# EAGLE design TAM_UNO (EAGLE 6.3)
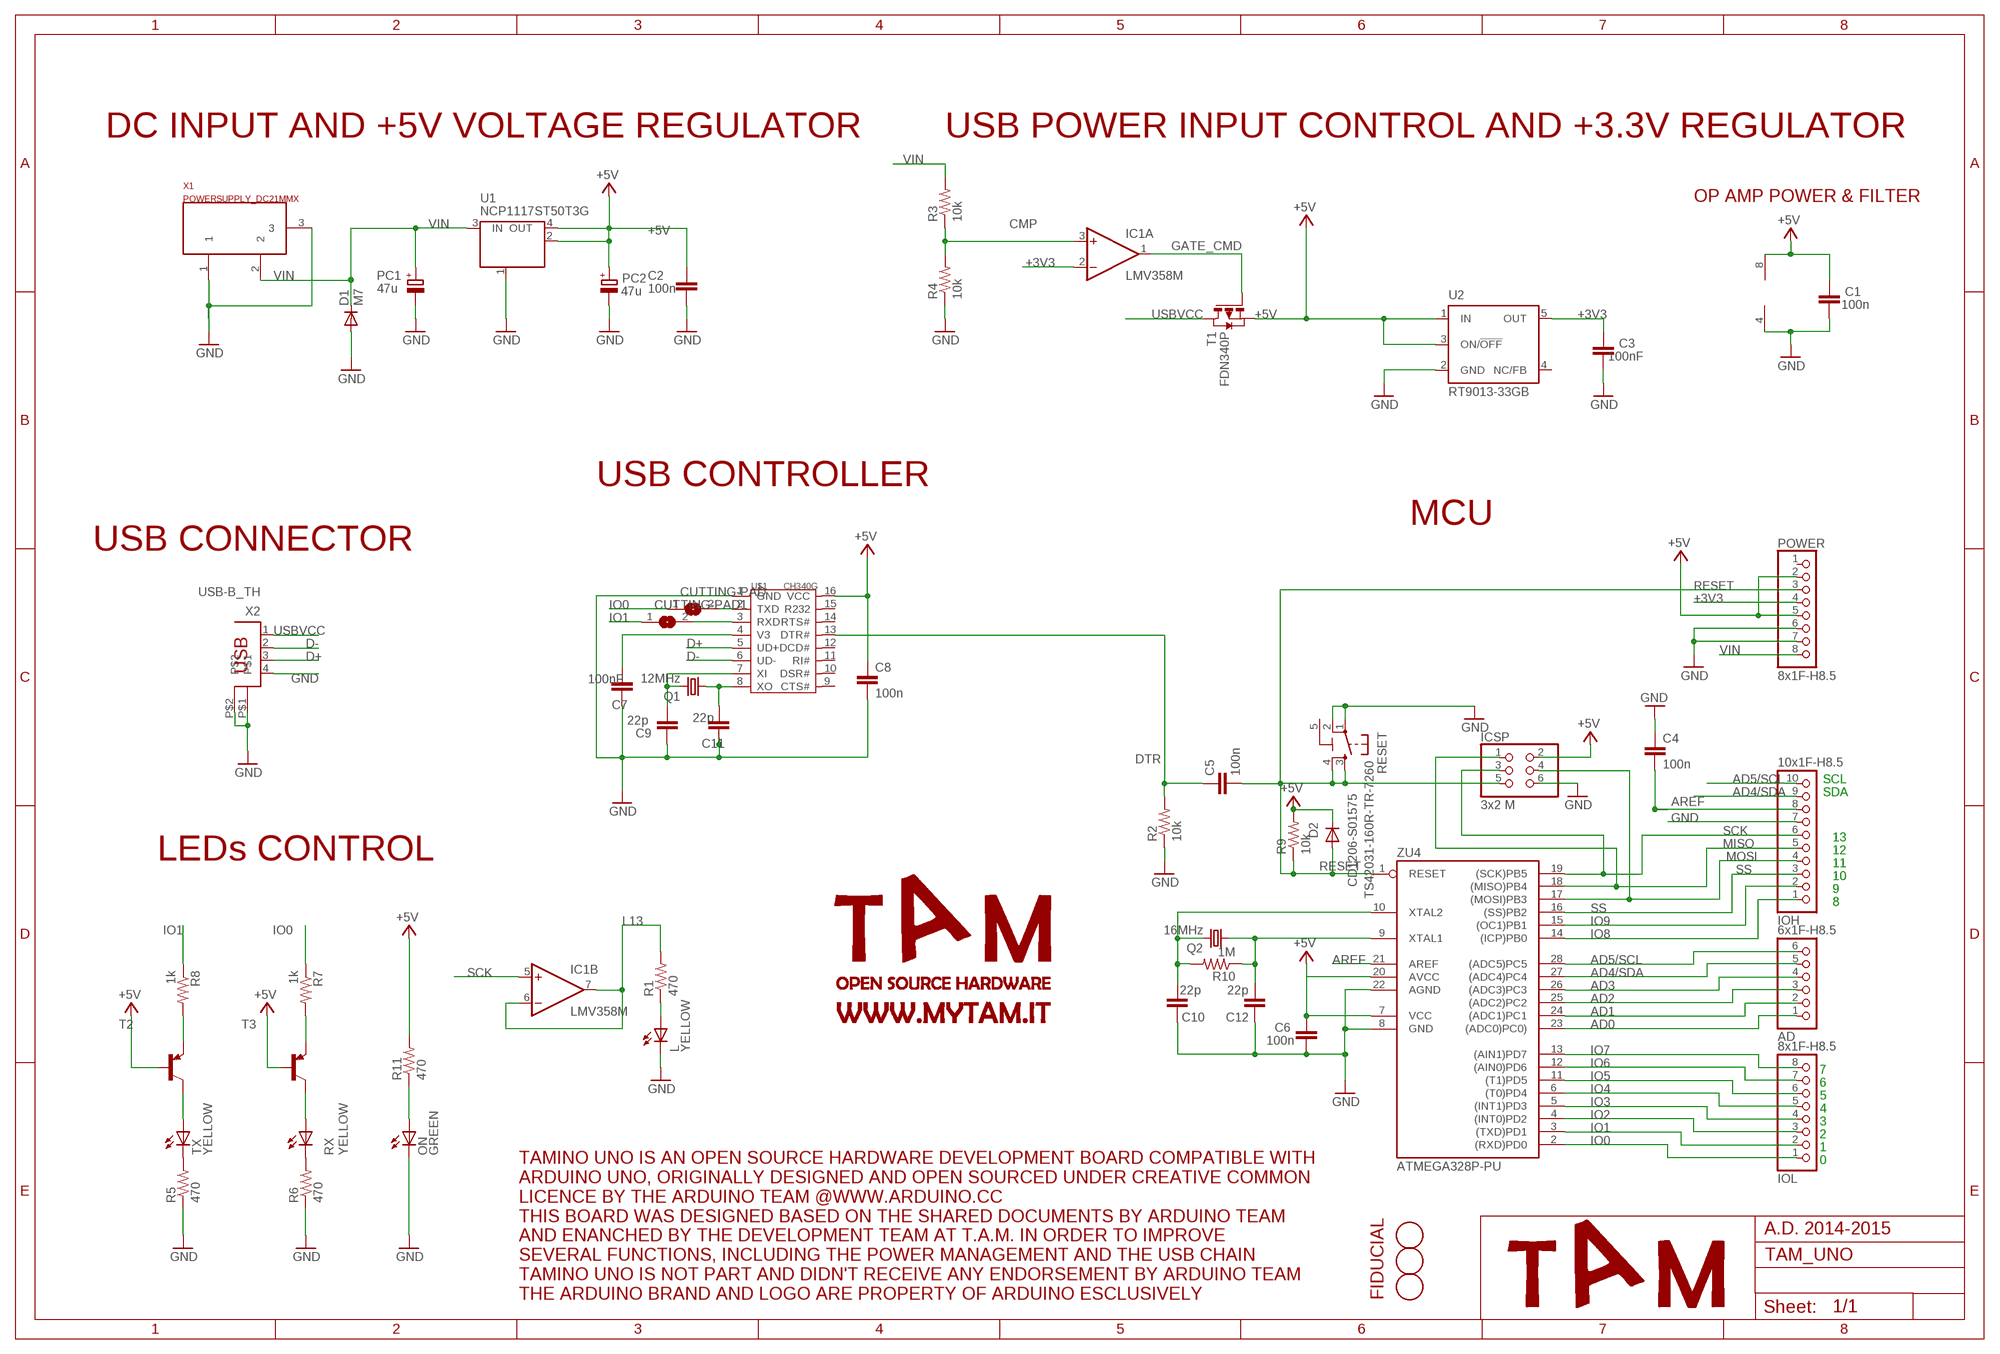
[diagram p0: schematic, sheet 1]

## Parts
AD  6x1F-H8.5  PINHD-1X6  [1X06]
C1  100n  C-EUC0603K  [C0603K]
C2  100n  C-EUC0603K  [C0603K]
C3  100nF  C-EUC0603K  [C0603K]
C4  100n  C-EUC0603K  [C0603K]
C5  100n  C-EUC0603K  [C0603K]
C6  100n  C-EUC0603K  [C0603K]
C7  100nF  C-EUC0603K  [C0603K]
C8  100n  C-EUC0603K  [C0603K]
C9  22p  C-EUC0603K  [C0603K]
C10  22p  C-EUC0603K  [C0603K]
C11  22p  C-EUC0603K  [C0603K]
C12  22p  C-EUC0603K  [C0603K]
CUTTING-PAD  SJ  [SJ]
CUTTING-PAD1  SJ  [SJ]
D1  M7  DIODE-SMB  [SMB]
D2  CD1206-S01575  DIODE-MINIMELF  [MINIMELF]
FD1  FIDUCIALMOUNT  [FIDUCIA-MOUNT]
FD2  FIDUCIALMOUNT  [FIDUCIA-MOUNT]
FD3  FIDUCIALMOUNT  [FIDUCIA-MOUNT]
IC1  LMV358M  [SO08]
ICSP  3x2 M  PINHD-2X3  [2X03]
IOH  10x1F-H8.5  PINHD-1X10_ARD  [1X10]
IOL  8x1F-H8.5  PINHD-1X8  [1X08]
L  YELLOW  LEDCHIP-LED0805  [CHIP-LED0805]
ON  GREEN  LEDCHIP-LED0805  [CHIP-LED0805]
PC1  47u  CPOL-EUD  [PANASONIC_D]
PC2  47u  CPOL-EUD  [PANASONIC_D]
POWER  8x1F-H8.5  PINHD-1X8  [1X08]
Q1  12MHz  CRYSTALSM49  [SM49]
Q2  16MHz  CRYSTALSM49  [SM49]
R1  470  R-US_R0603  [R0603]
R2  10k  R-US_R0603  [R0603]
R3  10k  R-US_R0603  [R0603]
R4  10k  R-US_R0603  [R0603]
R5  470  R-US_R0603  [R0603]
R6  470  R-US_R0603  [R0603]
R7  1k  R-US_R0603  [R0603]
R8  1k  R-US_R0603  [R0603]
R9  10k  R-US_R0603  [R0603]
R10  1M  R-US_R0603  [R0603]
R11  470  R-US_R0603  [R0603]
RESET  TS42031-160R-TR-7260  TS42  [TS42]
RX  YELLOW  LEDCHIP-LED0805  [CHIP-LED0805]
T1  FDN340P  PMOSSOT23  [SOT-23]
T2  -PNP-SOT23-EBC  [SOT23-EBC]
T3  -PNP-SOT23-EBC  [SOT23-EBC]
TX  YELLOW  LEDCHIP-LED0805  [CHIP-LED0805]
U1  NCP1117ST50T3G  MC33269ST-3.3T3  [SOT223]
U2  RT9013-33GB  LP2985-XXDBVR33  [SOT23-DBV]
U$1  CH340G  CH340GALT  [SSOP16]
X1  POWERSUPPLY_DC21MMX  [POWERSUPPLY_DC-21MM]
X2  USB-B_TH  PN61729  [PN61729]
ZU4  ATMEGA328P-PU  [DIL28-3]

## Nets
+3V3: C3.2 IC1.2(A:-IN) POWER.4 U2.5(OUT)
+5V [usbvcc]: C1.2 C2.2 C6.2 C8.1 D2.C IC1.8(P:V+) ICSP.2 PC2.+ POWER.2 POWER.5 R9.2 R11.2 T1.2(S) T2.B T3.B U1.2(OUT) U1.4(OUT) U2.1(IN) U2.3(ON/!OFF) U$1.16(VCC) ZU4.7(VCC) ZU4.20(AVCC)
AD0: AD.1 ZU4.23((ADC0)PC0))
AD1: AD.2 ZU4.24((ADC1)PC1)
AD2: AD.3 ZU4.25((ADC2)PC2)
AD3: AD.4 ZU4.26((ADC3)PC3)
AD4/SDA: AD.5 IOH.9 ZU4.27((ADC4)PC4)
AD5/SCL: AD.6 IOH.10 ZU4.28((ADC5)PC5)
AREF [aref]: C4.2 IOH.8 ZU4.21(AREF)
CMP: IC1.3(A:+IN) R3.1 R4.2
D+: U$1.5(UD+) X2.3
D-: U$1.6(UD-) X2.2
DTR: C5.1 R2.2 U$1.13(DTR#)
GATE_CMD: IC1.1(A:OUT) T1.3(G)
GND [gnd]: C1.1 C2.1 C3.1 C4.1 C6.1 C7.2 C8.2 C9.2 C10.2 C11.2 C12.2 D1.A IC1.4(P:V-) ICSP.6 IOH.7 L.C ON.C PC1.- PC2.- POWER.6 POWER.7 R2.1 R4.1 R5.1 R6.1 RESET.1 RESET.2 U1.1(GND/ADJ) U2.2(GND) U$1.1(GND) X1.1 X1.3 X2.4 X2.P$1 X2.P$2 ZU4.8(GND) ZU4.22(AGND)
IO0: CUTTING-PAD.1 IOL.1 R7.1 ZU4.2((RXD)PD0)
IO1: CUTTING-PAD1.1 IOL.2 R8.1 ZU4.3((TXD)PD1)
IO2: IOL.3 ZU4.4((INT0)PD2)
IO3: IOL.4 ZU4.5((INT1)PD3)
IO4: IOL.5 ZU4.6((T0)PD4)
IO5: IOL.6 ZU4.11((T1)PD5)
IO6: IOL.7 ZU4.12((AIN0)PD6)
IO7: IOL.8 ZU4.13((AIN1)PD7)
IO8: IOH.1 ZU4.14((ICP)PB0)
IO9: IOH.2 ZU4.15((OC1)PB1)
L13: IC1.6(B:-IN) IC1.7(B:OUT) R1.2
MISO: ICSP.1 IOH.5 ZU4.18((MISO)PB4)
MOSI: ICSP.4 IOH.4 ZU4.17((MOSI)PB3)
N$1: L.A R1.1
N$2: C9.1 Q1.2 U$1.7(XI)
N$3: ON.A R11.1
N$4: C11.1 Q1.1 U$1.8(XO)
N$5: R5.2 TX.C
N$6: R6.2 RX.C
N$7: R8.2 T2.E
N$8: R7.2 T3.E
N$9: T2.C TX.A
N$10: RX.A T3.C
N$11: C10.1 Q2.2 R10.2 ZU4.10(XTAL2)
N$12: C12.1 Q2.1 R10.1 ZU4.9(XTAL1)
N$13: CUTTING-PAD.2 U$1.2(TXD)
N$14: CUTTING-PAD1.2 U$1.3(RXD)
RESET: C5.2 D2.A ICSP.5 POWER.3 R9.1 RESET.3 RESET.4 ZU4.1(RESET)
SCK: IC1.5(B:+IN) ICSP.3 IOH.6 ZU4.19((SCK)PB5)
SS: IOH.3 ZU4.16((SS)PB2)
USBVCC [usbvcc]: T1.1(D) X2.1
V3: C7.1 U$1.4(V3)
VIN [power]: D1.C PC1.+ POWER.8 R3.2 U1.3(IN) X1.2
Unconnected: POWER.1 U2.4(NC/FB) U$1.9(CTS#) U$1.10(DSR#) U$1.11(RI#) U$1.12(DCD#) U$1.14(RTS#) U$1.15(R232)

## Notes on the sheet
- DC INPUT AND +5V VOLTAGE REGULATOR | USB POWER INPUT CONTROL AND +3.3V REGULATOR
- OP AMP POWER & FILTER
- USB CONTROLLER
- MCU
- USB CONNECTOR
- SCL
- SDA
- 13
- 12
- LEDs CONTROL
- 11
- 10
- 9
- 8
- 7
- 6
- 5
- 4
- 3
- 2
- 1
- 0
- A.D. 2014-2015
- TAMINO UNO IS AN OPEN SOURCE HARDWARE DEVELOPMENT BOARD COMPATIBLE WITH
  ARDUINO UNO, ORIGINALLY DESIGNED AND OPEN SOURCED UNDER CREATIVE COMMON
  LICENCE BY THE ARDUINO TEAM @WWW.ARDUINO.CC
  THIS BOARD WAS DESIGNED BASED ON THE SHARED DOCUMENTS BY ARDUINO TEAM
  AND ENANCHED BY THE DEVELOPMENT TEAM AT T.A.M. IN ORDER TO IMPROVE
  SEVERAL FUNCTIONS, INCLUDING THE POWER MANAGEMENT AND THE USB CHAIN
  TAMINO UNO IS NOT PART AND DIDN'T RECEIVE ANY ENDORSEMENT BY ARDUINO TEAM
  THE ARDUINO BRAND AND LOGO ARE PROPERTY OF ARDUINO ESCLUSIVELY
- FIDUCIAL

## Power pins joined to a net without a drawn wire
5-GND: RESET.5(5-GND)

## Library data of the parts
AD = SmartPrj:PINHD-1X6: PIN HEADER
C1-C12 = SmartPrj:C-EU: CAPACITOR, European symbol
CUTTING-PAD CUTTING-PAD1 = jumper:SJ: SMD solder JUMPER
D1 D2 = diode:DIODE-: DIODE
FD1-FD3 = SmartPrj:FIDUCIALMOUNT
IC1 = linear:LMV358?*: Dual General Purpose, Low Voltage, Rail-to-Rail Output Operational Amplifiers Source: http://www.national.com/mpf/LM/LMV321.html http://www.national.com/dt/lmv_qual.pdf
ICSP = SmartPrj:PINHD-2X3: PIN HEADER
IOH = SmartPrj:PINHD-1X10_ARD: PIN HEADER
IOL POWER = SmartPrj:PINHD-1X8: PIN HEADER
L ON RX TX = led:LED: LED OSRAM: - CHIPLED LG R971, LG N971, LY N971, LG Q971, LY Q971, LO R971, LY R971 LH N974, LH R974 LS Q976, LO Q976, LY Q976 LO Q996 - Hyper CHIPLED LW Q18S LB Q993, LB Q99A, LB R99A - SideLED LS A670, LO A670, LY A670, LG A670, LP A670 LB A673, LV A673, LT A673, LW A673 LH A674 LY A675 LS A676, LA A676, LO A676, LY A676, LW A676 LS A679, LY A679, LG A679 - Hyper Micro SIDELED® LS Y876, LA Y876, LO Y876, LY Y876 LT Y87S - SmartLED LW L88C, LW L88S LB L89C, LB L89S, LG L890 LS L89K, LO L89K, LY L89K LS L896, LA L896, LO L896, LY L896 - TOPLED LS T670, LO T670, LY T670, LG T670, LP T670 LSG T670, LSP T670, LSY T670, LOP T670, LYG T670 LG T671, LOG T671, LSG T671 LB T673, LV T673, LT T673, LW T673 LH T674 LS T676, LA T676, LO T676, LY T676, LB T676, LH T676, LSB T676, LW T676 LB T67C, LV T67C, LT T67C, LS T67K, LO T67K, LY T67K, LW E67C LS E67B, LA E67B, LO E67B, LY E67B, LB E67C, LV E67C, LT E67C LW T67C LS T679, LY T679, LG T679 LS T770, LO T770, LY T770, LG T770, LP T770 LB T773, LV T773, LT T773, LW T773 LH T774 LS E675, LA E675, LY E675, LS T675 LS T776, LA T776, LO T776, LY T776, LB T776 LHGB T686 LT T68C, LB T68C - Hyper Mini TOPLED® LB M676 - Mini TOPLED Santana® LG M470 LS M47K, LO M47K, LY M47K Source: http://www.osram.convergy.de LUXEON: - LUMILED® LXK2-PW12-R00, LXK2-PW12-S00, LXK2-PW14-U00, LXK2-PW14-V00 LXK2-PM12-R00, LXK2-PM12-S00, LXK2-PM14-U00 LXK2-PE12-Q00, LXK2-PE12-R00, LXK2-PE12-S00, LXK2-PE14-T00, LXK2-PE14-U00 LXK2-PB12-K00, LXK2-PB12-L00, LXK2-PB12-M00, LXK2-PB14-N00, LXK2-PB14-P00, LXK2-PB14-Q00 LXK2-PR12-L00, LXK2-PR12-M00, LXK2-PR14-Q00, LXK2-PR14-R00 LXK2-PD12-Q00, LXK2-PD12-R00, LXK2-PD12-S00 LXK2-PH12-R00, LXK2-PH12-S00 LXK2-PL12-P00, LXK2-PL12-Q00, LXK2-PL12-R00 Source: www.luxeon.com KINGBRIGHT: KA-3528ASYC Source: www.kingbright.com
PC1 PC2 = rcl:CPOL-EU: POLARIZED CAPACITOR, European symbol
Q1 Q2 = crystal:CRYSTAL: CRYSTAL; OC_FARNELL: unknown; OC_NEWARK: unknown
R1-R11 = resistor:R-US_: RESISTOR, American symbol
RESET = SmartPrj:TS42: TS42 Dongnan Electronics Tact switch VDC 12V - 50mA
T1 = zetex:PMOSSOT23: MOS FET
T2 T3 = transistor:*-PNP-: PNP Transistror
U1 = linear:MC33269ST*: Adjustable Output Low Dropout Voltage Regulator 800 mA Source: http://www.onsemi.com/pub/Collateral/MC33269-D.PDF
U2 = SmartPrj:LP2985-XXDBVR: ULTRALOW-POWER 50-mA LOW-DROPOUT LINEAR REGULATORS 50-mA Low-Dropout Regulator Source: http://focus.ti.com/lit/ds/symlink/tps77001.pdf
U$1 = 11dimitri:CH340G
X1 = SmartPrj:POWERSUPPLY_DC21MM
X2 = SmartPrj:PN61729: BERG USB connector
ZU4 = SmartPrj:ATMEGA328P-: MICROCONTROLLER 4 Kbytes FLASH 128 bytes SRAM 256 bytes EEPROM UART 6-channel 10 bit ADC

## Net classes
0 default: width 0.254 mm, clearance 0.254 mm
1 power: width 0.61 mm, drill 0.61 mm, clearance 0.254 mm
2 gnd: width 0.305 mm, drill 0.559 mm, clearance 0.254 mm
3 usbvcc: width 0.508 mm, drill 0.61 mm, clearance 0.254 mm
4 aref: width 0.406 mm, drill 0.61 mm, clearance 0.254 mm

## Board
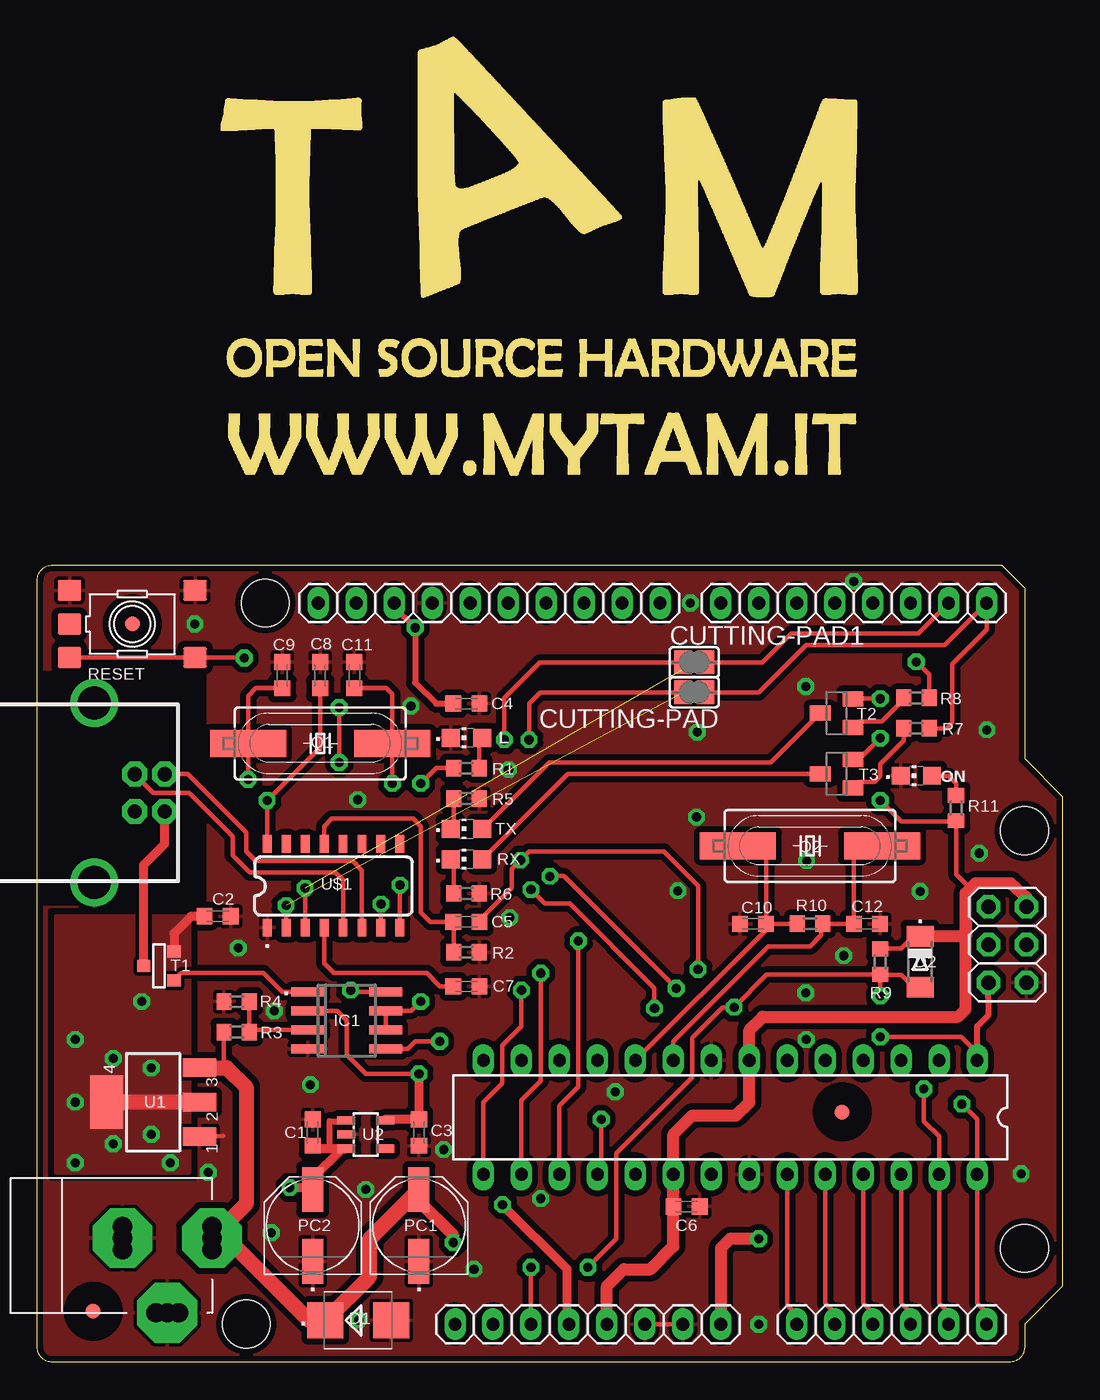
[diagram p1: board, top side]
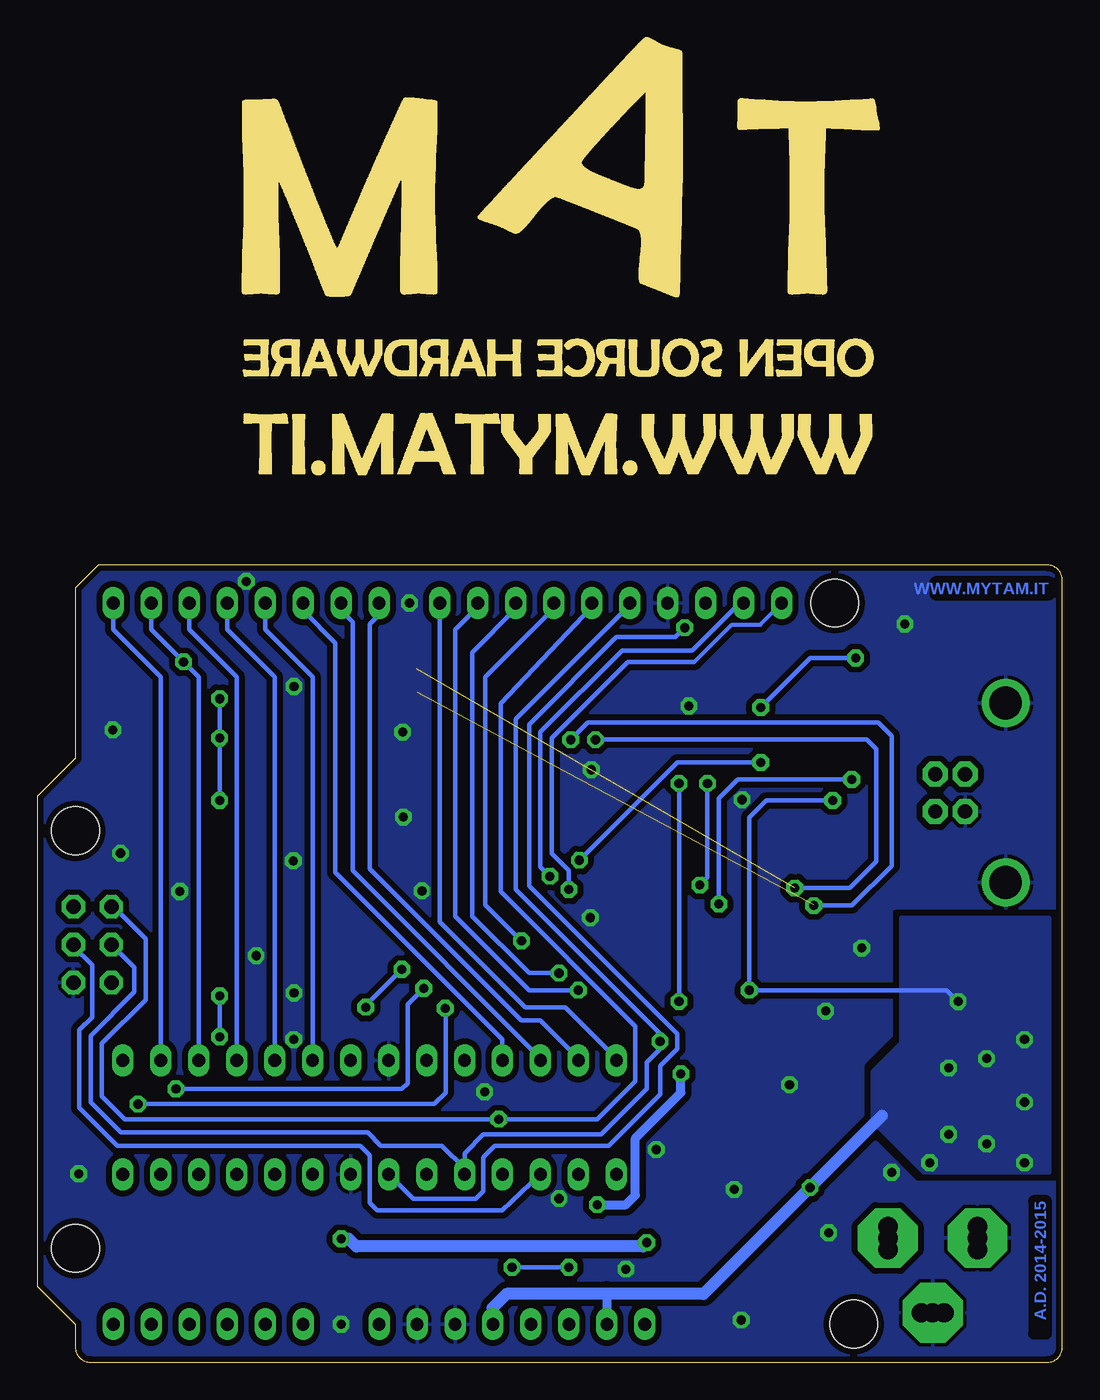
[diagram p2: board, bottom side, seen from below]

Size 68.58 x 88.66 mm. Coordinates in mm from the lower left corner, seen from the top.
Outline: 64.52,53.34 66.04,51.82 66.04,40.39 68.58,37.85 68.58,5.08 66.04,2.54 66.04,1 arc-90 65.04,0 1,0 arc-90 0,1 0,52.34 arc-90 1,53.34 64.52,53.34
Copper layers (1*16): Top 0.035mm / dielectric 1.5mm / Bottom 0.035mm
Design rules "default *": minimum track width 10mil, minimum drill 22mil, track to track 10mil, track to pad 10mil, pad to pad 10mil, via to via 12mil, smd to smd 8mil, copper to edge 10mil, drill to drill 12mil, minimum pad ring 10mil, minimum via ring 10mil, stop-mask expansion 1mil, vias tented up to drill 30mil, thermal gap 10mil
Holes 3.2 mm at 66.04,35.56 66.04,7.62 15.24,50.8 13.97,2.54
vRestrict: area 22.9,44.1 to 24.6,49.1; area 25.4,45.5 to 27.1,49.1; area 28.4,45.3 to 29.6,48.8; area 31,45.3 to 32.1,48.8; area 33.5,45.3 to 34.7,48.8; area 36.1,45.3 to 37.2,48.8; area 38.7,47.2 to 39.9,48.8; area 40.3,45.1 to 47.6,46.9; area 60.3,44.2 to 61.7,46.7; area 62.9,44.2 to 64.3,46.7; area 60.8,39.1 to 64.3,40.5; area 0.6,21.8 to 2,30.1; area 5.7,22.6 to 7.4,30.1; area 47.9,10.3 to 48.5,10.8; area 50.4,10.2 to 50.9,11; area 11.3,28.8 to 12.7,31.1; area 44.8,47.5 to 46.1,48.9; area 47.6,47.4 to 48.8,48.9; area 50.2,47.4 to 51.3,48.9; area 52.8,47.4 to 54,48.9; area 55.2,47.4 to 56.4,48.9; area 57.9,47.4 to 59.1,48.9; area 60.5,47.4 to 61.6,48.9; area 63,47.4 to 64.1,48.9; area 41.3,47.2 to 42.4,48.8; area 0.3,12.4 to 9.4,24.5

### Footprints (pad centres in the part's own frame; a part is rotated, then mirrored left to right if it is on the bottom)
1X06 = drill 0.85 pad 1.422 long: 1 -6.35,0; 2 -3.81,0; 3 -1.27,0; 4 1.27,0; 5 3.81,0; 6 6.35,0
C0603K = smd 1.05 x 1.08: 1 -0.875,0; 2 0.875,0
SJ = smd 1.168 x 1.6: 1 -0.762,0; 2 0.762,0
SMB = smd 2.4 x 2.4: A 2.2,0; C -2.2,0
MINIMELF = smd 1.4 x 1.8: A 1.7,0; C -1.7,0
FIDUCIA-MOUNT = smd 1.016 x 1.016: P$1 0,0
SO08 = smd 0.6 x 2.2: 1 -1.905,-2.6; 2 -0.635,-2.6; 3 0.635,-2.6; 4 1.905,-2.6; 5 1.905,2.6; 6 0.635,2.6; 7 -0.635,2.6; 8 -1.905,2.6
2X03 = drill 0.95 pad 1.55 octagon: 1 -2.54,-1.27; 2 -2.54,1.27; 3 0,-1.27; 4 0,1.27; 5 2.54,-1.27; 6 2.54,1.27
1X10@1 = drill 0.85 pad 1.422 long: 1 -11.43,0; 2 -8.89,0; 3 -6.35,0; 4 -3.81,0; 5 -1.27,0; 6 1.27,0; 7 3.81,0; 8 6.35,0; 9 8.89,0; 10 11.43,0
1X08 = drill 0.85 pad 1.422 long: 1 -8.89,0; 2 -6.35,0; 3 -3.81,0; 4 -1.27,0; 5 1.27,0; 6 3.81,0; 7 6.35,0; 8 8.89,0
CHIP-LED0805 = smd 1.2 x 1.2: A 0,-1.05; C 0,1.05
PANASONIC_D = smd 3 x 1.4: + 2.4,0; - -2.4,0
SM49 = smd 5.08 x 1.778: 1 -4.826,0; 2 4.826,0
R0603 = smd 1 x 1.1: 1 -0.85,0; 2 0.85,0
TS42 = smd 1.6 x 1.4: 1 -4.2,2.25; 2 4.2,2.25; 3 -4.2,-2.25; 4 4.2,-2.25; 5 -4.2,0
SOT-23 = smd 0.787 x 0.889: 1 0.025,-1.016; 2 -0.94,1.016; 3 0.991,1.016
SOT23-EBC = smd 1 x 1.4: B 0.95,-1.1; C 0,1.1; E -0.95,-1.1
SOT223 = smd 1.219 x 2.235: 1 -2.311,-3.099; 2 0,-3.099; 3 2.311,-3.099 | smd 3.6 x 2.2: 4 0,3.099
SOT23-DBV = smd 0.55 x 1.2: 1 -0.95,-1.3; 2 0,-1.3; 3 0.95,-1.3; 4 0.95,1.3; 5 -0.95,1.3
SSOP16 = smd 0.6 x 1.2: 1 -4.445,-2.8; 2 -3.175,-2.8; 3 -1.905,-2.8; 4 -0.635,-2.8; 5 0.635,-2.8; 6 1.905,-2.8; 7 3.175,-2.8; 8 4.445,-2.8; 9 4.445,2.8; 10 3.175,2.8; 11 1.905,2.8; 12 0.635,2.8; 13 -0.635,2.8; 14 -1.905,2.8; 15 -3.175,2.8; 16 -4.445,2.8
POWERSUPPLY_DC-21MM = drill 1.3 pad 4 octagon: 1 -5.08,-3.353; 2 -0.076,-6.35; 3 -0.076,-0.356 | drill 1.3: 4 -5.08,-4.115; 5 -5.08,-2.591; 6 -0.838,-0.356; 7 0.686,-0.356; 8 -0.838,-6.35; 9 0.686,-6.35
PN61729 = drill 0.95 pad 1.676 octagon: 1 1.25,4.71; 2 -1.25,4.71; 3 -1.25,2.71; 4 1.25,2.71 | drill 2.2: P$1 -6,0; P$2 6,0
DIL28-3 = drill 0.85 pad 1.422 long: 1 -16.51,-3.81; 2 -13.97,-3.81; 3 -11.43,-3.81; 4 -8.89,-3.81; 5 -6.35,-3.81; 6 -3.81,-3.81; 7 -1.27,-3.81; 8 1.27,-3.81; 9 3.81,-3.81; 10 6.35,-3.81; 11 8.89,-3.81; 12 11.43,-3.81; 13 13.97,-3.81; 14 16.51,-3.81; 15 16.51,3.81; 16 13.97,3.81; 17 11.43,3.81; 18 8.89,3.81; 19 6.35,3.81; 20 3.81,3.81; 21 1.27,3.81; 22 -1.27,3.81; 23 -3.81,3.81; 24 -6.35,3.81; 25 -8.89,3.81; 26 -11.43,3.81; 27 -13.97,3.81; 28 -16.51,3.81

### Placement (x,y rotation side)
AD  57.15,2.54 0 top
C1  18.41,15.37 270 top
C2  12.06,29.84 180 top
C3  25.53,15.37 90 top
C4  28.7,44.07 180 top
C5  28.7,29.46 0 top
C6  43.43,10.41 180 top
C7  28.7,25.15 0 top
C8  18.92,45.97 90 top
C9  16.38,45.97 90 top
C10  47.88,29.34 180 top
C11  21.21,45.97 90 top
C12  55.5,29.34 0 top
CUTTING-PAD  43.94,44.83 180 top
CUTTING-PAD1  43.94,46.84 0 top
D1  21.46,2.79 0 top
D2  59.05,26.8 270 top
FD1  6.35,49.4 0 top
FD2  53.84,16.74 0 top
FD3  3.73,3.41 0 top
IC1  20.7,22.86 270 top
ICSP  64.9,27.94 270 top
IOH  10x1F-H8.5  [1X10@1]  30.23,50.8 180 top
IOL  54.61,50.8 180 top
L  28.7,41.78 90 top
ON  58.8,39.24 90 top
PC1  25.53,9.14 90 top
PC2  18.41,9.14 90 top
POWER  36.83,2.54 0 top
Q1  18.92,41.4 180 top
Q2  51.69,34.54 180 top
R1  28.7,39.75 180 top
R2  28.7,27.43 180 top
R3  13.34,22.1 180 top
R4  13.34,24.13 0 top
R5  28.7,37.72 180 top
R6  28.7,31.37 180 top
R7  58.8,42.42 180 top
R8  58.8,44.45 180 top
R9  56.39,26.8 90 top
R10  51.69,29.34 180 top
R11  61.47,37.08 270 top
RESET  6.35,49.4 0 top
RX  28.7,33.66 90 top
T1  8.13,26.54 270 top
T2  53.47,43.43 90 top
T3  53.47,39.37 90 top
TX  28.7,35.69 90 top
U1  7.75,17.4 90 top
U2  21.97,15.24 270 top
U$1  19.81,31.88 0 top
X1  5.33,8.38 90 top
X2  3.81,38.1 270 top
ZU4  46.35,16.38 180 top

### Tracks (layer width: path | path; a pad name or v marks a point on that pad's centre or on a via)
+3V3  (via drill 0.61)
  Top 0.305: IC1.2 20.07,23.5 20.7,22.86 20.7,20.57 21.97,19.3 v25.53,19.3
  Top 0.61: v31.11,10.54 35.43,6.22 35.43,2.67 POWER.4 | U2.5 23.34,16.26 C3.2 v25.53,19.3
  Bottom 0.61: v31.11,10.54 29.21,10.54 28.57,11.18 28.57,14.99 25.53,18.03 v25.53,19.3
+5V  (via drill 0.61)
  Top 0.305: D2.C 58.6,28.5 57.78,27.69 56.43,27.69 R9.2 | 62.42,31.69 61.47,32.64 R11.2 61.43,36.2 57.78,36.2 v56.39,37.59 | IC1.8 21.08,24.77 v20.95,24.89 | U$1.16 v15.37,37.59 18.92,41.15 C8.1 | v56.39,44.4 54.58,44.4 T2.B | T3.B 54.95,40.32 v56.39,41.76
  Top 0.406: 42.55,10.16 42.35,10.35 | U2.1 20.61,16.13 19.56,16.13 19.56,14.29
  Top 0.508: 11.02,17.42 U1.2 | ICSP.2 66.04,30.48
  Top 0.61: C6.2 42.58,10.88 42.55,11.43 | 11.05,29.72 C2.2 10.29,29.84 9.14,28.7 T1.2 | v16.89,11.68 18.78,11.68 PC2.+ 18.41,12.32 20.39,14.29 U2.3 19.56,14.29 18.6,14.29 C1.2
  Top 0.813: 66.17,30.44 ICSP.2 66.17,31.11 65.1,32.05 62.79,32.05 62.42,31.69 62.1,31.37 62.1,29.46 | 62.1,29.46 62.1,23.62 61.59,23.11 48.51,23.11 47.62,22.23 ZU4.7 47.62,17.4 46.74,16.51 43.81,16.51 42.55,15.24 ZU4.20 42.55,11.43 C6.2 42.55,10.16 42.55,7.75 41.02,6.22 39.24,6.22 38.1,5.08 POWER.5 | D2.C 62.13,28.5 62.1,29.46
  Top 1.016: U1.4 5.84,17.4 5.87,17.42 11.02,17.42
  Bottom 0.305: v6.99,24.13 7.75,24.89 v20.95,24.89 20.95,36.45 19.81,37.59 v15.37,37.59 | v56.39,37.59 56.39,40.74 v56.39,41.76 v56.39,44.4
  Bottom 0.61: POWER.2 30.48,4.7 30.61,4.57
  Bottom 0.813: POWER.5 38.12,3.63 37.19,4.57 30.61,4.57 24,4.57 v16.89,11.68 12.06,16.51
  other vias: 2.54,21.59 5.08,20.32 2.54,13.34 5.08,14.61 2.54,17.4 8.89,13.34 7.62,15.24 7.62,19.68
  pour Bottom (isolate 0.406, no thermals): 0.89,29.72 10.79,29.72 10.79,21.34 12.7,19.43 12.7,16.13 9.27,12.7 0.89,12.7
  pour Top (no thermals): 1.27,12.7 1.27,29.84 10.16,29.84 10.16,12.7
AD0
  Top 0.305: ZU4.23 50.16,3.81 50.8,3.17 AD.1
AD1
  Top 0.305: ZU4.24 52.7,3.94 53.34,3.3 AD.2
AD2
  Top 0.305: ZU4.25 55.24,3.94 55.88,3.3 AD.3
AD3
  Top 0.305: ZU4.26 57.78,3.94 58.42,3.3 AD.4
AD4/SDA  (via drill 0.61)
  Top 0.305: v59.31,18.29 59.31,16.13 60.33,15.11 ZU4.27 60.33,3.94 60.96,3.3 AD.5 | v42.74,25.01 35.2,32.54 34.31,32.54 v34.29,32.51
  Bottom 0.305: IOH.9 21.59,50.8 24.77,47.62 29.46,47.62 34.92,42.16 34.92,33.15 v34.29,32.51 | v59.31,18.29 44.2,18.29 43.81,18.67 43.81,23.93 v42.74,25.01
AD5/SCL  (via drill 0.61)
  Top 0.305: v61.85,17.27 62.87,16.26 ZU4.28 62.87,3.94 63.5,3.3 AD.6 | v41.29,23.69 41.27,23.7 41.27,25.02 35.61,30.68 33.96,30.68 v33.02,31.62
  Bottom 0.254: IOH.10 20.22,49.35 22.12,49.35 24.64,46.86
  Bottom 0.305: v61.85,17.27 42.04,17.27 41.27,18.03 41.27,23.67 v41.29,23.69 | 24.64,46.86 29.08,46.86 34.16,41.78 34.16,34.04 33.02,32.89 v33.02,31.62
AREF  (via drill 0.61)
  Top 0.406: IOH.8 23.88,50.55 v25.27,49.15 25.27,45.47 26.67,44.07 C4.2
  Bottom 0.305: ZU4.21 43.43,10.92 39.24,10.92 38.73,11.43 38.73,13.72 37.97,14.48 30.35,14.48 26.92,17.91 26.92,19.81 25.78,20.95 25.78,21.97 35.69,31.88 35.69,42.67 29.84,48.51 25.91,48.51 v25.27,49.15
CMP
  Top 0.305: R4.2 R3.1 14.31,22.23 IC1.3
D+
  Top 0.305: X2.3 6.52,39.33 7.75,38.1 10.16,38.1 13.08,35.18 13.08,33.91 14.22,32.77 19.94,32.77 20.45,32.26 U$1.5 | U$1.5 20.45,28.93 20.47,29.01 20.47,29.17 U$1.5
D-
  Top 0.305: X2.2 10.05,39.35 13.97,35.43 13.97,34.16 14.61,33.53 21.08,33.53 21.72,32.89 U$1.6
DTR
  Top 0.305: R2.2 27.85,29.44 C5.1 26.29,29.46 25.65,30.1 25.65,35.87 25.15,36.37 19.68,36.37 19.18,35.87 U$1.13
GATE_CMD
  Top 0.305: IC1.1 16.38,24.77 15.11,26.04 9.63,26.04 T1.3 9.17,25.53
GND  (via drill 0.61)
  Top 0.305: POWER.6 POWER.7 | U1.1 12.45,15.14
  other vias: 29.21,6.22 27.18,14.22 15.65,8.66 54.61,52.25 11.43,12.7 33.68,10.95 51.44,21.59 43.69,50.8 48.26,2.54 21.49,2.82 63.53,42.32 65.81,12.6 38.66,18.08 10.54,49.4 44.15,42.16 21.97,11.56 63.02,34.06 18.26,18.57 15.85,23.5 13.44,27.71 59.05,31.5 24.99,43.92 31.52,39.65 51.41,45.21 44.09,36.47 51.46,33.55 51.41,24.71 53.95,27.2 31.6,29.74 21.44,37.64 42.85,31.55
  pour Bottom (isolate 0.406, rank 2): 0,53.34 68.96,53.34 69.22,53.09 69.22,0 0.25,0 0,0.25
  pour Top (isolate 0.406, rank 2): 0,53.34 68.58,53.34 68.58,0 0,0 -0.13,30.48 11.43,30.48 11.43,46.35 0,46.35
IO0  (via drill 0.61)
  Top 0.305: R7.1 60.83,42.42 61.21,42.8 61.21,46.74 63.5,49.02 IOL.1 60.71,48.01 51.44,48.01 48.26,44.83 CUTTING-PAD.1 43.31,44.83 43.18,44.81 33.63,44.81 32.89,44.07 v32.89,41.66
  Bottom 0.305: ZU4.2 60.33,45.85 63.5,49.02 IOL.1 | v16.64,30.56 14.1,30.56 11.43,33.22 11.43,41.91 12.32,42.8 31.75,42.8 v32.89,41.66
IO1  (via drill 0.61)
  Top 0.305: v31.24,41.66 31.24,44.45 33.6,46.81 43.46,46.81 | IOL.2 58.93,48.77 50.42,48.77 48.49,46.84 44.3,46.84 44.3,46.81 43.46,46.81 | R8.1 59.65,46.01 v58.8,46.86 | 43.46,46.81 CUTTING-PAD1.1
  Bottom 0.305: ZU4.3 57.78,45.85 v58.8,46.86 60.96,49.02 IOL.2 | v17.91,31.73 14.22,31.73 12.45,33.5 12.45,41.02 13.08,41.66 v31.24,41.66
IO2
  Bottom 0.305: ZU4.4 55.24,45.85 58.42,49.02 IOL.3
IO3
  Bottom 0.305: ZU4.5 52.7,45.85 55.88,49.02 IOL.4
IO4
  Bottom 0.305: ZU4.6 50.16,45.85 53.34,49.02 IOL.5
IO5
  Bottom 0.305: IOL.6 50.8,50.29 48.64,48.13 48.64,32.77 37.47,21.59 ZU4.11
IO6
  Bottom 0.305: IOL.7 48.26,50.29 47.5,49.53 47.5,32.89 34.92,20.32
  Bottom 0.406: ZU4.12 34.92,20.32
IO7
  Bottom 0.305: IOL.8 45.72,50.04 46.35,49.4 46.35,33.02 36.2,22.86 34.92,22.86 32.38,20.32
  Bottom 0.406: ZU4.13 32.38,20.32
IO8
  Bottom 0.305: 29.84,20.32 33.27,23.75 35.94,23.75 41.66,29.46 IOH.1
  Bottom 0.406: ZU4.14 29.84,20.32
IO9  (via drill 0.61)
  Top 0.305: ZU4.15 29.84,17.4 31.11,18.67 31.11,21.21 32.38,22.48 v32.38,24.89
  Bottom 0.305: v32.38,24.89 35.69,24.89 40.64,29.84 40.64,49.02 39.12,50.55 IOH.2
L13  (via drill 0.61)
  Top 0.305: IC1.6 IC1.7 25.02,23.5 v25.65,24.13 | R1.2 26.67,39.75 v25.65,38.73
  Bottom 0.305: v25.65,24.13 v25.65,38.73
MISO  (via drill 0.61)
  Top 0.305: v37.72,16.26 37.72,12.83 ZU4.18
  Bottom 0.305: IOH.5 31.5,50.55 37.59,44.07 37.59,31.5 28.57,22.48 28.57,18.8 31.11,16.26 v37.72,16.26 62.74,16.26 64.26,17.78 64.26,21.34 61.34,24.26 61.34,28.32 63.45,30.43 ICSP.1
MOSI  (via drill 0.61)
  Top 0.305: ZU4.17 34.92,17.14 36.2,18.41 v36.2,28.19
  Bottom 0.305: IOH.4 34.04,50.42 38.61,45.85 38.61,30.61 v36.2,28.19 | ICSP.4 66.18,27.83 64.9,26.57 64.9,23.09 65.79,22.23 65.79,17.02 63.25,14.48 46.99,14.48 46.35,13.84 46.35,10.67 45.85,10.16 37.47,10.16 ZU4.17
N$1
  Top 0.305: R1.1 29.55,41.58 L.A
N$2  (via drill 0.61)
  Top 0.305: C9.1 14.62,45.1 14.1,44.58 Q1.2 v14.1,38.99 | v22.99,30.66 U$1.7
  Bottom 0.305: v14.1,38.99 21.72,38.99 22.99,37.72 v22.99,30.66
N$3
  Top 0.305: ON.A 60.96,39.24 61.47,38.73 R11.1
N$4  (via drill 0.61)
  Top 0.305: C11.1 23.35,45.1 23.75,44.7 Q1.1 v23.75,38.73 | v24.26,31.93 U$1.8
  Bottom 0.305: v23.75,38.73 23.75,32.44 v24.26,31.93
N$5
  Top 0.305: R5.2 27.85,35.89 TX.C
N$6
  Top 0.305: R6.2 27.85,33.45 RX.C
N$7
  Top 0.305: R8.2 57.95,44.34 56.49,42.88 54.96,42.88 T2.E
N$8
  Top 0.305: R7.2 57.95,41.59 56.39,40.03 56.39,39.22 55.98,38.81 54.96,38.81 T3.E 54.58,38.41
N$9
  Top 0.305: TX.A 29.79,35.69 34.24,40.13 49.06,40.13 T2.C
N$10
  Top 0.305: T3.C 35.47,39.37 RX.A
N$11
  Top 0.305: R10.2 C10.1 | C10.1 48.75,34.18 48.51,34.42 46.99,34.42 Q2.2 | C10.1 48.75,28.94 ZU4.10
N$12
  Top 0.305: Q2.1 56.39,34.42 54.61,34.42 54.62,34.4 C12.1 R10.1 52.45,29.25 52.45,28.57 51.69,27.81 48.9,27.81 42.55,21.46 ZU4.9
N$13  (1 unrouted)
  Top 0.305: U$1.2 16.64,30.61
N$14  (1 unrouted)
  Top 0.305: CUTTING-PAD1.2 43.31,46.84 43.18,47.12 | 43.18,47.12 43.05,47.12 | U$1.3 17.91,31.75 | 43.18,47.12 43.2,47.12 43.2,46.38
RESET  (via drill 0.61)
  Top 0.305: R9.1 v56.39,24.51 | v56.39,21.77 61.8,21.77 62.87,20.7 | D2.A 58.6,25.1 57.78,25.91 56.43,25.91 R9.1 | R9.1 48.81,25.95 v46.61,23.75 45.85,23.75 43.81,21.72 43.81,19.05 38.73,13.97 38.73,8.26 v36.83,6.35 | RESET.3 RESET.4 13.81,47.15 v13.84,47.12 | v20.19,43.81 v20.19,40.13 | v33.02,6.35 POWER.3 | C5.2 29.58,29.58 31.75,31.75 31.75,33.02 v32.32,33.59 32.89,34.16 41.91,34.16 44.2,31.88 v44.2,26.29
  Top 0.406: ICSP.5 63.64,23.25 62.87,22.48 62.87,20.7 ZU4.1
  Bottom 0.305: v56.39,24.51 v56.39,21.77 | v46.61,23.75 46.61,23.88 v44.2,26.29 | v13.84,47.12 16.89,47.12 v20.19,43.81 | v20.19,40.13 25.78,40.13 v32.32,33.59 | v36.83,6.35 v33.02,6.35
SCK  (via drill 0.61)
  Top 0.305: IC1.5 24.77,20.95 25.27,21.46 v26.92,21.46
  Bottom 0.305: ICSP.3 62.1,26.42 62.1,24.77 65.02,21.84 65.02,17.4 62.99,15.37 46.48,15.37 45.59,14.48 41.53,14.48 40.01,12.95 40.01,13.97 38.73,15.24 30.86,15.24 27.81,18.29 27.81,20.07 26.92,20.95 v26.92,21.46 26.92,21.97 36.58,31.62 36.58,43.05 28.96,50.67
  Bottom 0.406: 40.01,12.95 ZU4.19 | 28.96,50.67 IOH.6
SS  (via drill 0.61)
  Top 0.305: v33.68,26.04 33.68,18.82 32.38,17.53 ZU4.16
  Bottom 0.305: IOH.3 36.58,50.42 39.5,47.5 39.5,29.84 35.69,26.04 v33.68,26.04
USBVCC
  Top 0.61: T1.1 7.11,33.27 8.51,34.67 8.51,36.84 X2.1
V3
  Top 0.305: C7.1 26.92,25.15 26.04,26.04 19.81,26.04 19.18,26.67 U$1.4
VIN  (via drill 0.61)
  Top 0.305: R3.2 12.48,19.75 12.45,19.71
  Top 0.61: PC1.+ 25.54,11.43
  Top 0.813: v48.26,8.26 46.35,8.26 45.72,7.62 POWER.8 | 25.53,10.79 27.81,8.51 v27.81,8
  Top 1.016: U1.3 12.45,19.71 12.68,19.71 13.97,18.41 13.97,10.59 X1.2 11.73,8.26 12.7,8.26 18.16,2.79 D1.C 19.3,2.79 22.23,5.71 22.23,8.24 PC1.+ | 25.54,11.43 25.54,10.81 25.53,10.79
  Bottom 0.813: v48.26,8.26 47.75,8.26 47.24,7.75 28.07,7.75 v27.81,8

### Text on the board
Bottom: WWW.MYTAM.IT | A.D. 2014-2015
Dimension: TAMINO UNO IS AN OPEN SOURCE HARDWARE DEVELOPMENT BOARD COMPATIBLE WITH / ARDUINO UNO, ORIGINALLY DESIGNED AND OPEN SOURCED UNDER CREATIVE COMMON / LICENCE BY THE ARDUINO TEAM @WWW.ARDUINO.CC / THIS BOARD WAS DESIGNED BASED ON THE SHARED DOCUMENTS BY ARDUINO TEAM / AND ENANCHED BY THE DEVELOPMENT TEAM AT T.A.M. IN ORDER TO IMPROVE / SEVERAL FUNCTIONS, INCLUDING THE POWER MANAGEMENT AND THE USB CHAIN / TAMINO UNO IS NOT PART AND DIDN'T RECEIVE ANY ENDORSEMENT BY ARDUINO TEAM / THE ARDUINO BRAND AND LOGO ARE PROPERTY OF ARDUINO ESCLUSIVELY
tNames: C9 | C11 | C4 | . | L | . | . | TX | . | RX | C2 | C5 | . | . | T1 | D2 | . | U1 | C1 | U2 | C3 | PC2 | PC1 | C6 | . | . | D1 | .
ReferenceLC: L | TX | ON | RX | PC1 | PC2
_Words: AREF | GND | 13 | 12 | 11 | 10 | 9 | 8 | 7 | 6 | 5 | 4 | 3 | 2 | 1 | 0 | SCL | SDA | # | # | # | # | # | # | DIGITAL | L | [#=PWM] | TX | RX | ON | TX | RX | 1 | ANALOG IN | IOREF | RESET | 3.3V | 5V | GND | GND | VIN | A0 | A1 | A2 | A3 | A4 | A5
Graphs: SCHEDA PER / ESPERIMENTI / ELETTRONICI | TM | ARDUINO UNO / COMPATIBILE | 8058773620019
214bmp: D:/SmartProjects/Snc/a4_bn_logo2.bmp